# Altium project Bass Guitar Amp.PrjPcb (part 2 of 4)
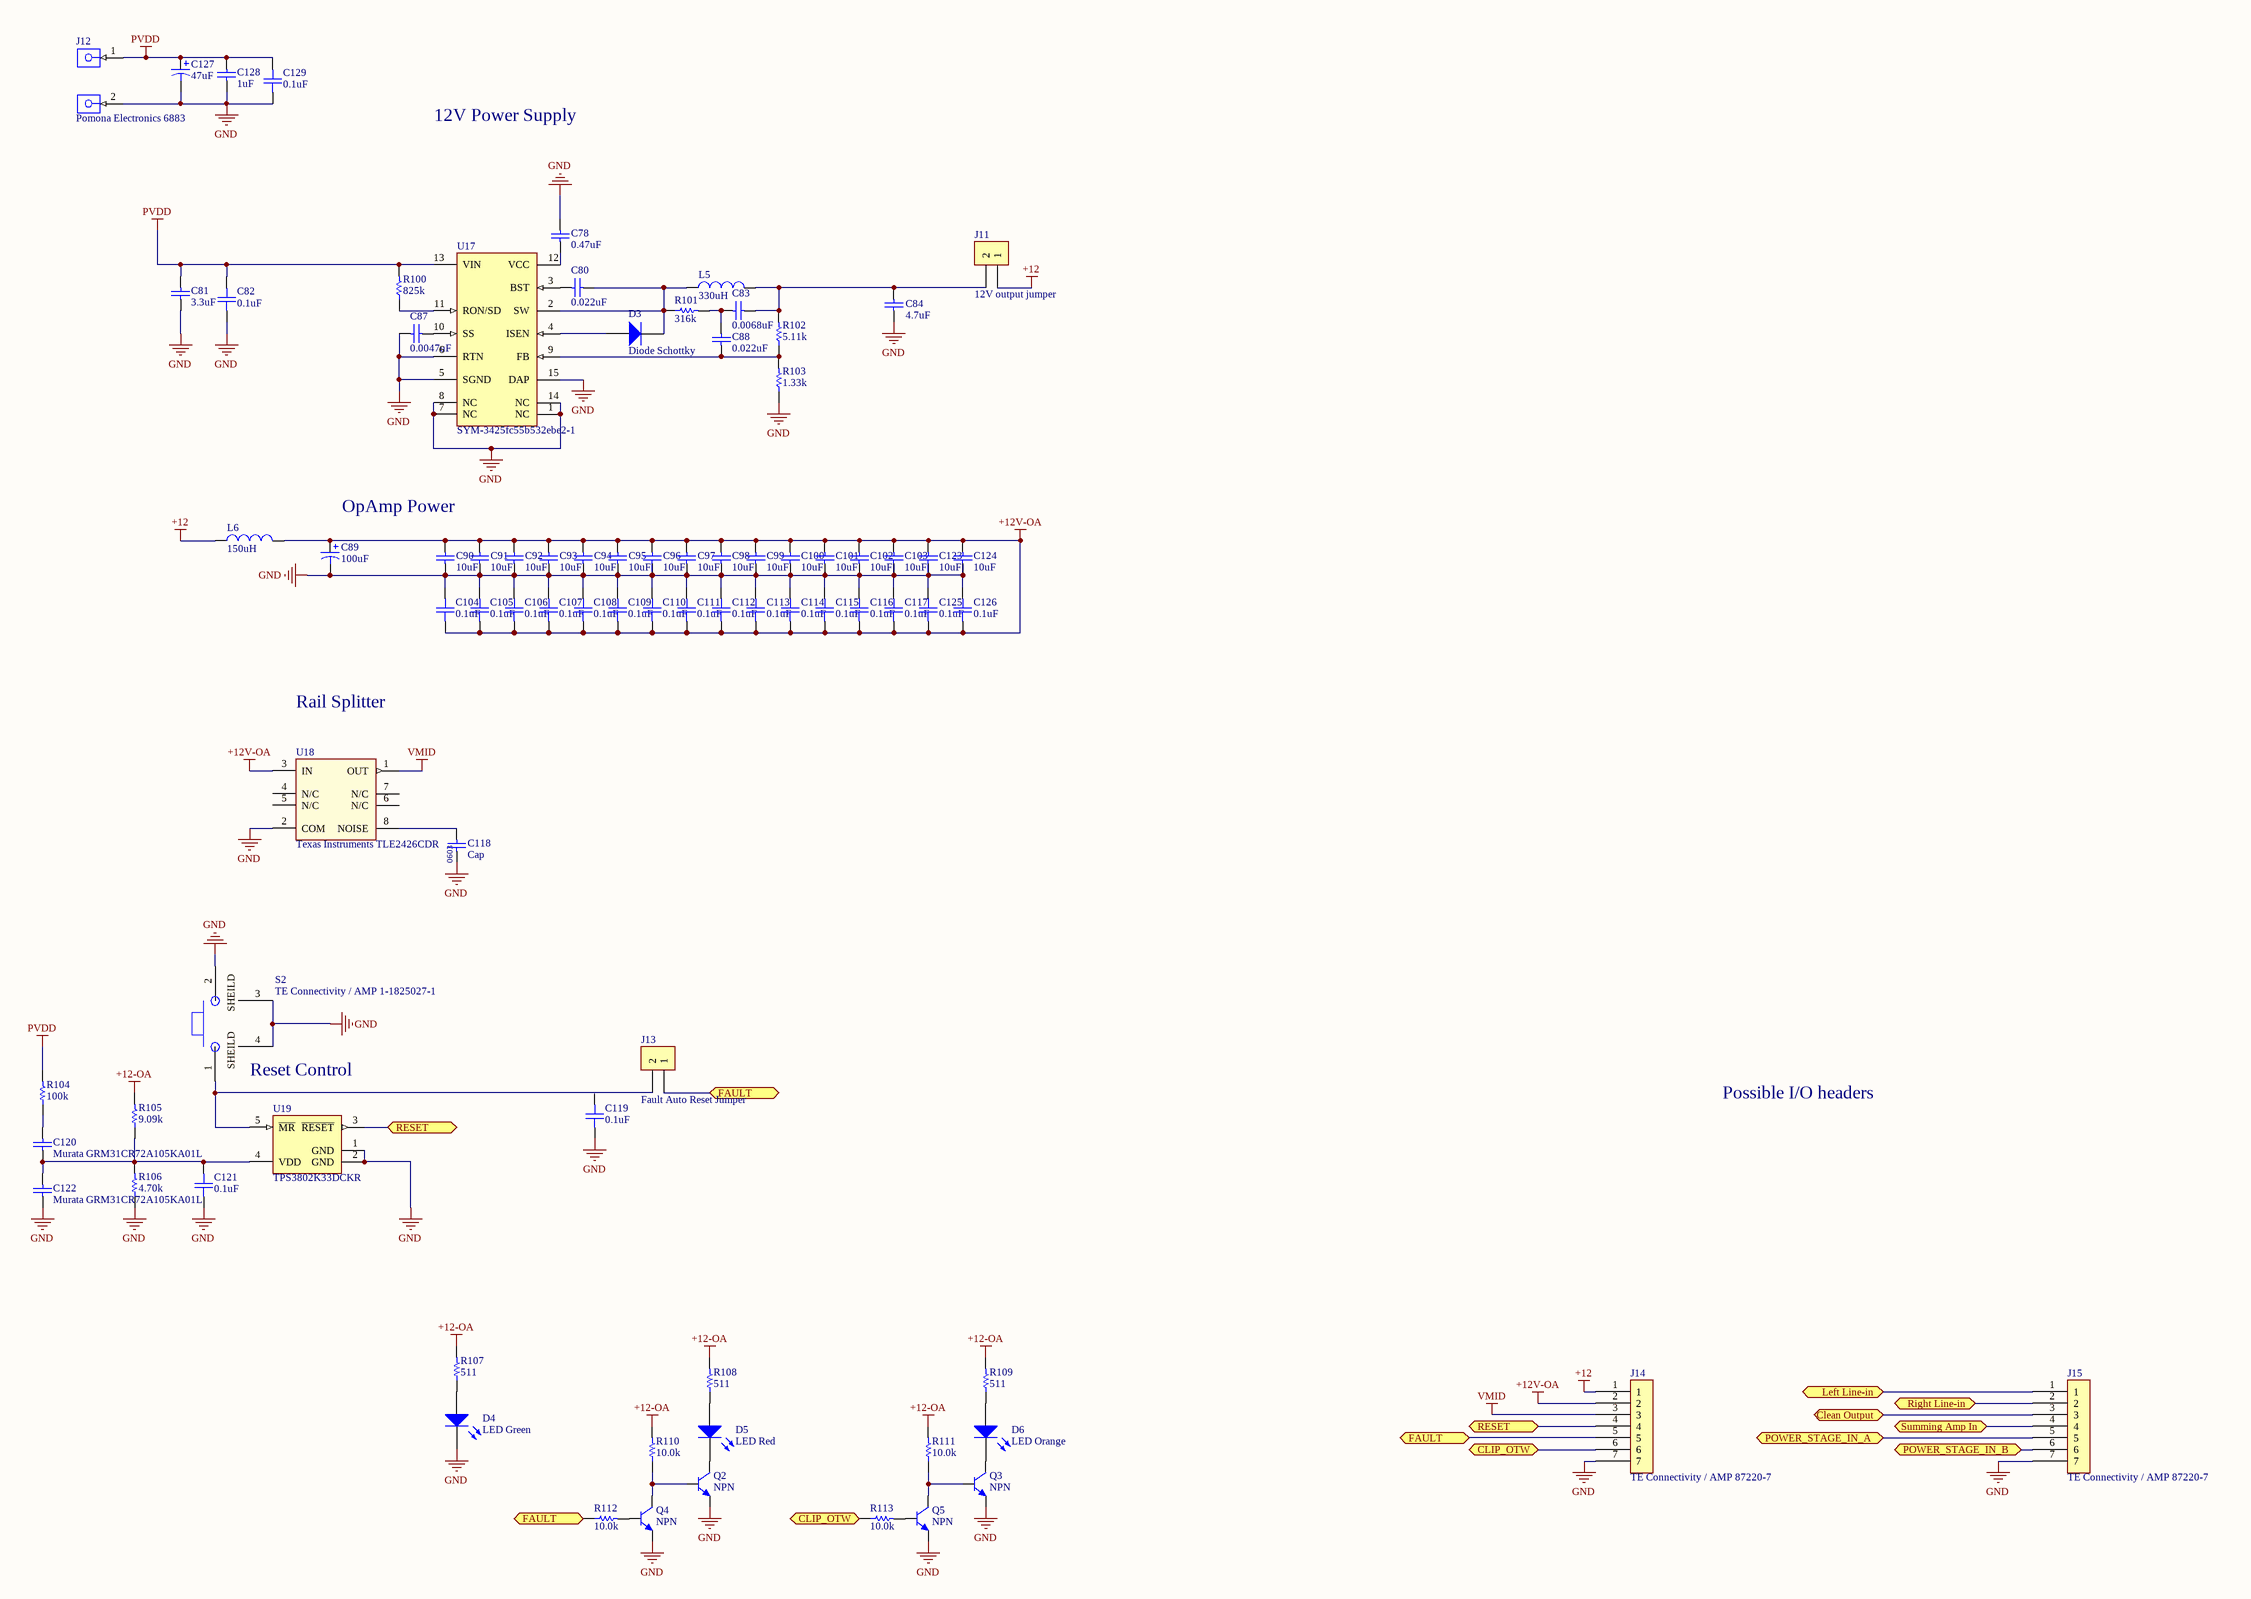
[diagram p5: Power Management.SchDoc]

## Sheet Power Management.SchDoc (continued)
C89 = CMP-0978c15ef0cfd6bf-1: Cap Aluminum Lytic 100uF 25V 20% (6.3 X 7.7mm) SMD 290mA 5000h 105